# EAGLE design dac single ended 32-2 (EAGLE 4.13)
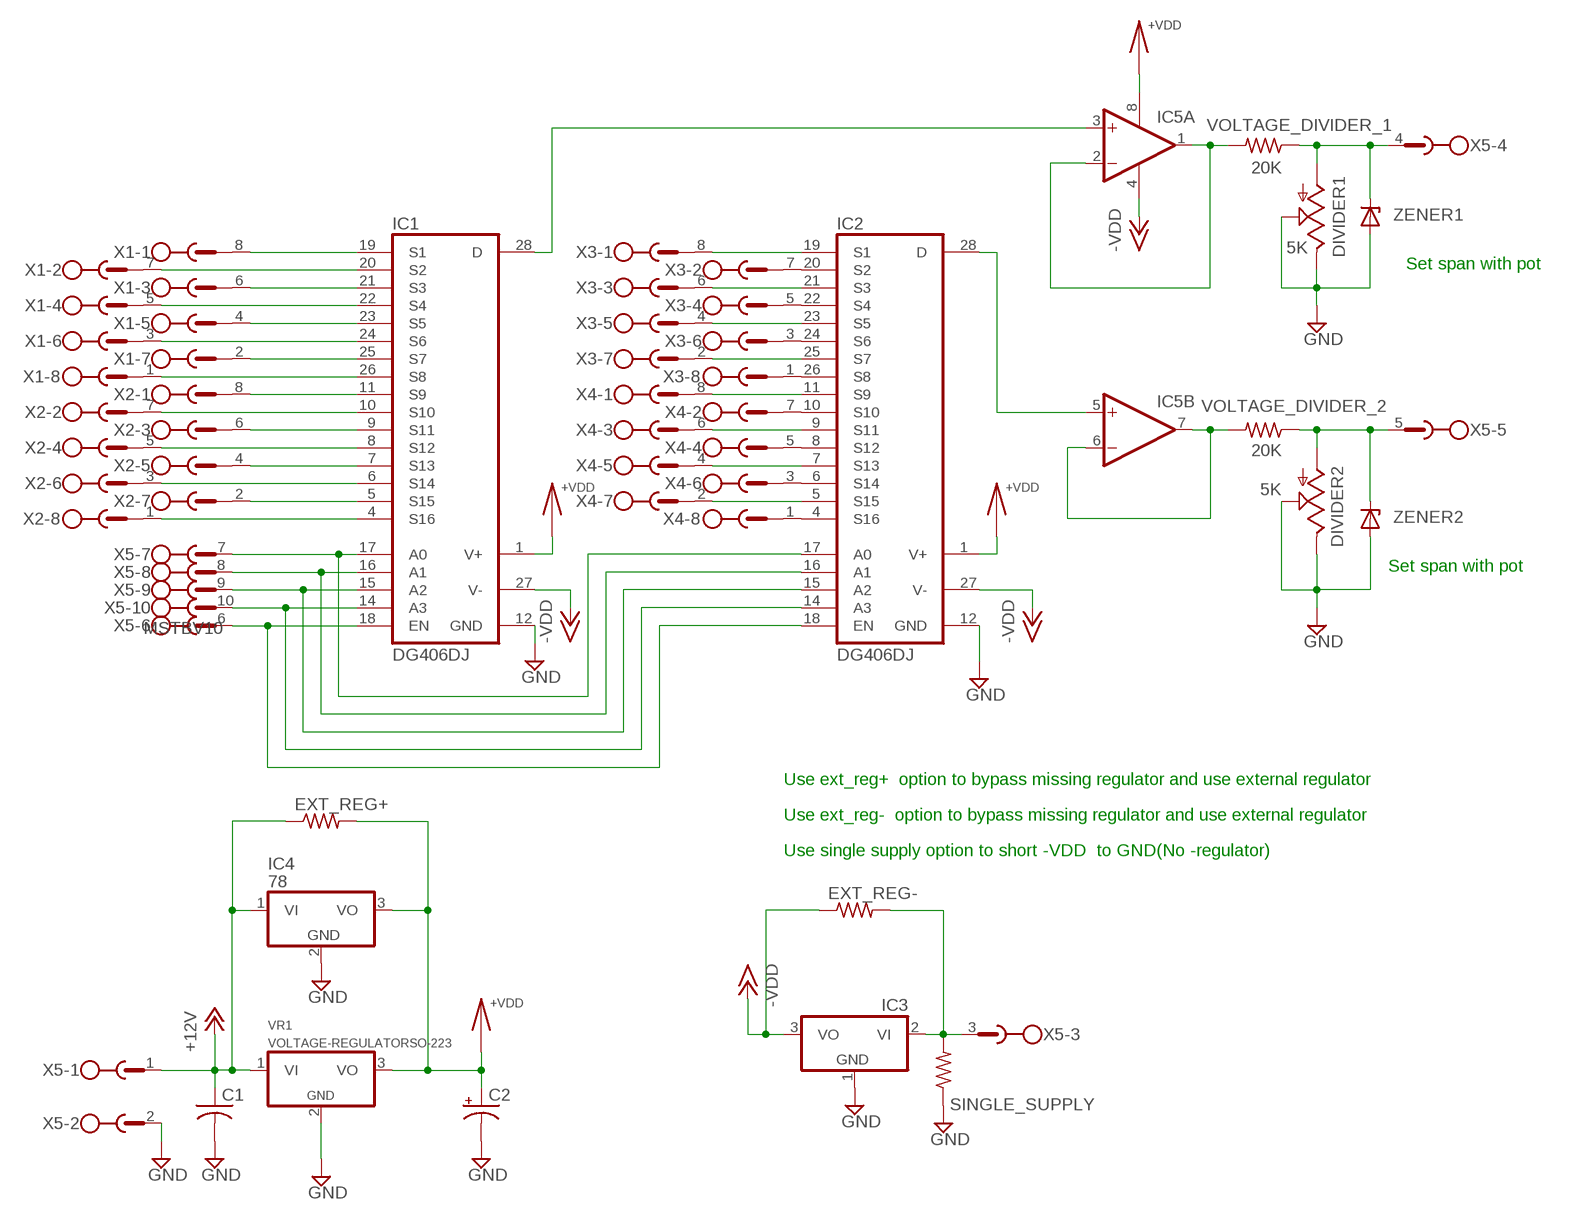
[diagram p0: schematic, sheet 1]

## Parts
C1  CAPACITOR-NO-POLARITYC1210K  [C1210K]
C2  CAPACITOR-ELECTROLYTICG  [PANASONIC_G]
DIVIDER1  5K  TRIM_US-RJ9W  [RJ9W]
DIVIDER2  5K  TRIM_US-RJ9W  [RJ9W]
EXT_REG+  RESISITORM1406  [M1406]
EXT_REG-  RESISITORM1406  [M1406]
IC1  DG406DJ  [DIL28-6]
IC2  DG406DJ  [DIL28-6]
IC3  79  [TO220S]
IC4  78  [TO220S]
IC5  2AMP_P8+4D  [SO08]
SINGLE_SUPPLY  RESISITORM1406  [M1406]
VOLTAGE_DIVIDER_1  20K  RESISITORM1406  [M1406]
VOLTAGE_DIVIDER_2  20K  RESISITORM1406  [M1406]
VR1  VOLTAGE-REGULATORSO-223  [SOT223R_INFINEON]
X1  MSTBV8  [MSTBV8]
X2  MSTBV8  [MSTBV8]
X3  MSTBV8  [MSTBV8]
X4  MSTBV8  [MSTBV8]
X5  MSTBV10  [MSTBV10]
ZENER1  ZENER-DIODESOD80C  [SOD80C]
ZENER2  ZENER-DIODESOD80C  [SOD80C]

## Nets
+12V: C1.1 EXT_REG+.1 IC4.1(VI) VR1.1(VI) X5.1
+VDD: C2.+ EXT_REG+.2 IC1.1(V+) IC2.1(V+) IC4.3(VO) IC5.8(P:V+) VR1.3(VO)
-15V: EXT_REG-.1 IC1.27(V-) IC2.27(V-) IC3.3(VO) IC5.4(P:V-) ; supply symbol labelled -VDD
GND: C1.2 C2.- DIVIDER1.E DIVIDER1.S DIVIDER2.E DIVIDER2.S IC1.12(GND) IC2.12(GND) IC3.1(GND) IC4.2(GND) SINGLE_SUPPLY.1 VR1.2(GND) X5.2 ZENER1.A ZENER2.A
N$1: IC1.19(S1) X1.8
N$2: IC1.20(S2) X1.7
N$3: IC1.21(S3) X1.6
N$4: IC1.22(S4) X1.5
N$5: IC1.23(S5) X1.4
N$6: IC1.24(S6) X1.3
N$7: IC1.25(S7) X1.2
N$8: IC1.26(S8) X1.1
N$9: IC1.11(S9) X2.8
N$10: IC1.10(S10) X2.7
N$11: IC1.9(S11) X2.6
N$12: IC1.8(S12) X2.5
N$13: IC1.7(S13) X2.4
N$14: IC1.6(S14) X2.3
N$15: IC1.5(S15) X2.2
N$16: IC1.4(S16) X2.1
N$17: IC2.19(S1) X3.8
N$18: IC2.20(S2) X3.7
N$19: IC2.21(S3) X3.6
N$20: IC2.22(S4) X3.5
N$21: IC2.23(S5) X3.4
N$22: IC2.24(S6) X3.3
N$23: IC2.25(S7) X3.2
N$24: IC2.26(S8) X3.1
N$25: IC2.11(S9) X4.8
N$26: IC2.10(S10) X4.7
N$27: IC2.9(S11) X4.6
N$28: IC2.8(S12) X4.5
N$29: IC2.7(S13) X4.4
N$30: IC2.6(S14) X4.3
N$31: IC2.5(S15) X4.2
N$32: IC2.4(S16) X4.1
N$33: IC1.17(A0) IC2.17(A0) X5.7
N$34: IC1.16(A1) IC2.16(A1) X5.8
N$35: IC1.15(A2) IC2.15(A2) X5.9
N$36: IC1.14(A3) IC2.14(A3) X5.10
N$37: IC1.18(EN) IC2.18(EN) X5.6
N$38: DIVIDER1.A VOLTAGE_DIVIDER_1.1 X5.4 ZENER1.C
N$40: EXT_REG-.2 IC3.2(VI) SINGLE_SUPPLY.2 X5.3
N$41: IC2.28(D) IC5.5(B:+IN)
N$42: IC5.6(B:-IN) IC5.7(B:OUT) VOLTAGE_DIVIDER_2.2
N$43: IC1.28(D) IC5.3(A:+IN)
N$44: IC5.1(A:OUT) IC5.2(A:-IN) VOLTAGE_DIVIDER_1.2
N$45: DIVIDER2.A VOLTAGE_DIVIDER_2.1 X5.5 ZENER2.C

## Notes on the sheet
- Set span with pot
- Set span with pot
- Use ext_reg+  option to bypass missing regulator and use external regulator
- Use ext_reg-  option to bypass missing regulator and use external regulator
- Use single supply option to short -VDD  to GND(No -regulator)

## Library data of the parts
C1 = 1 Dan's Common Parts:CAPACITOR-NO-POLARITY: CAPACITOR, American symbol
C2 = 1 Dan's Common Parts:CAPACITOR-ELECTROLYTIC: POLARIZED CAPACITOR, American symbol
DIVIDER1 DIVIDER2 = pot:TRIM_US-: POTENTIOMETER
EXT_REG+ EXT_REG- SINGLE_SUPPLY VOLTAGE_DIVIDER_1 VOLTAGE_DIVIDER_2 = 1 Dan's Common Parts:RESISITOR: RESISTOR, American symbol
IC1 IC2 = maxim:DG406DJ: ANALOG MULTIPLEXER
IC3 = linear:79*: Negative VOLTAGE REGULATOR
IC4 = linear:78*: Positive VOLTAGE REGULATOR
IC5 = 1 Dan's Common Parts:2AMP_P8+4: OP AMP
VR1 = 1 Dan's Common Parts:VOLTAGE-REGULATOR: Positive VOLTAGE REGULATOR Source: http://cache.national.com/ds/LM/LM78L05.pdf http://www.fairchildsemi.com/ds/LM/LM7805.pdf
X1-X4 = con-phoenix-500:MSTBV8: PHOENIX
X5 = con-phoenix-508:MSTBV10: PHOENIX
ZENER1 ZENER2 = 1 Dan's Common Parts:ZENER-DIODE: Z-Diode

## Board
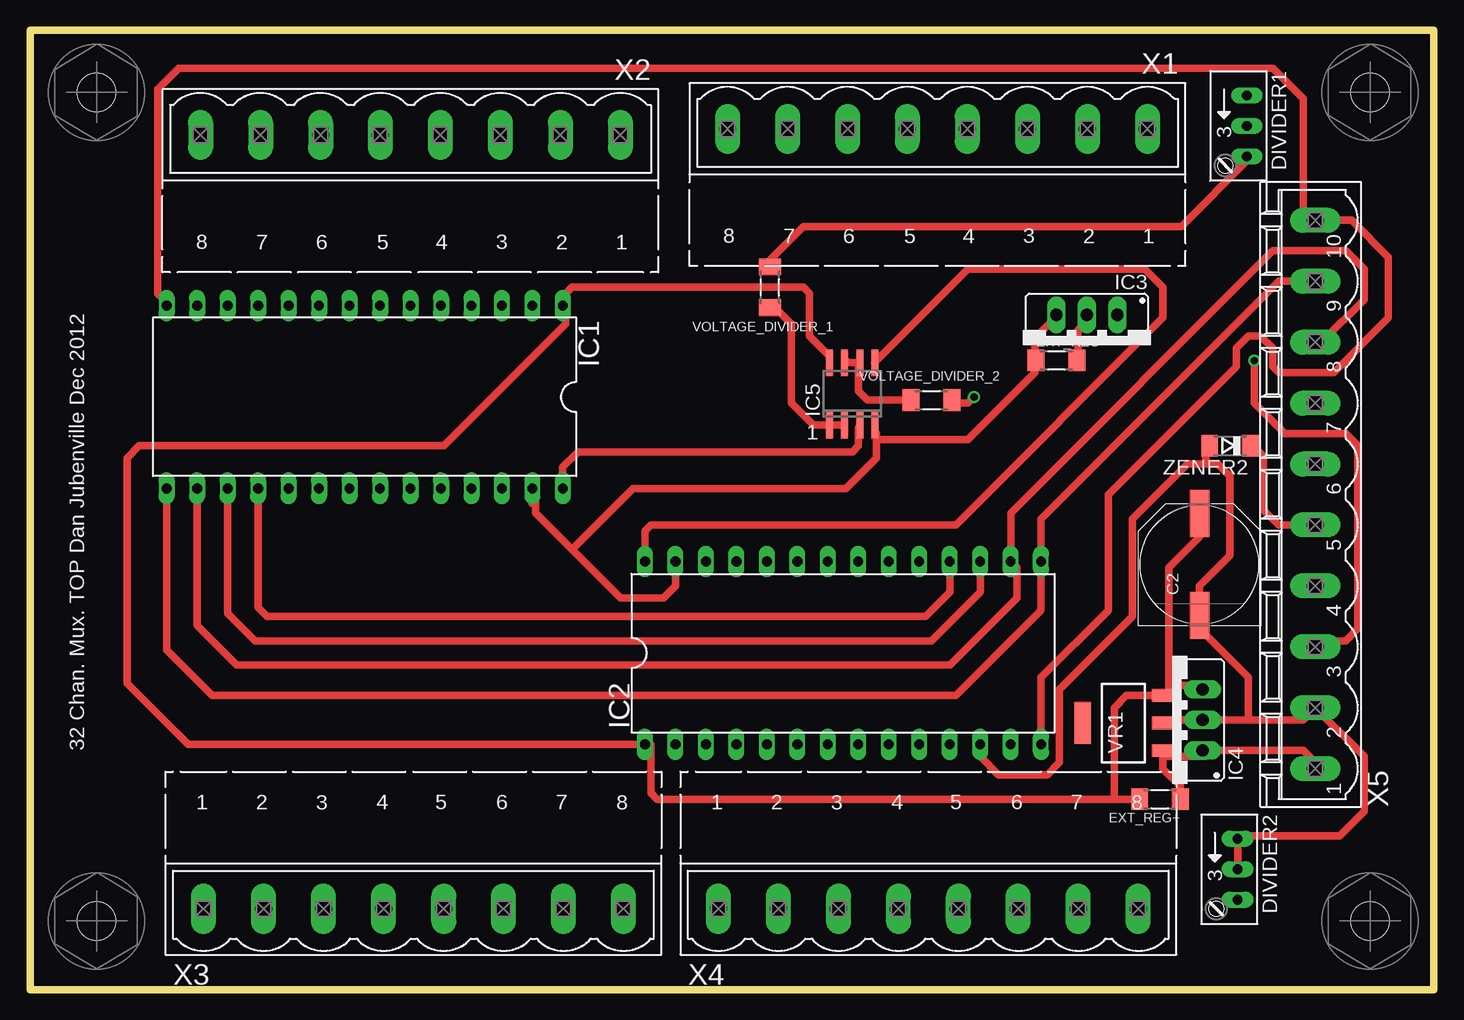
[diagram p1: board, top side]
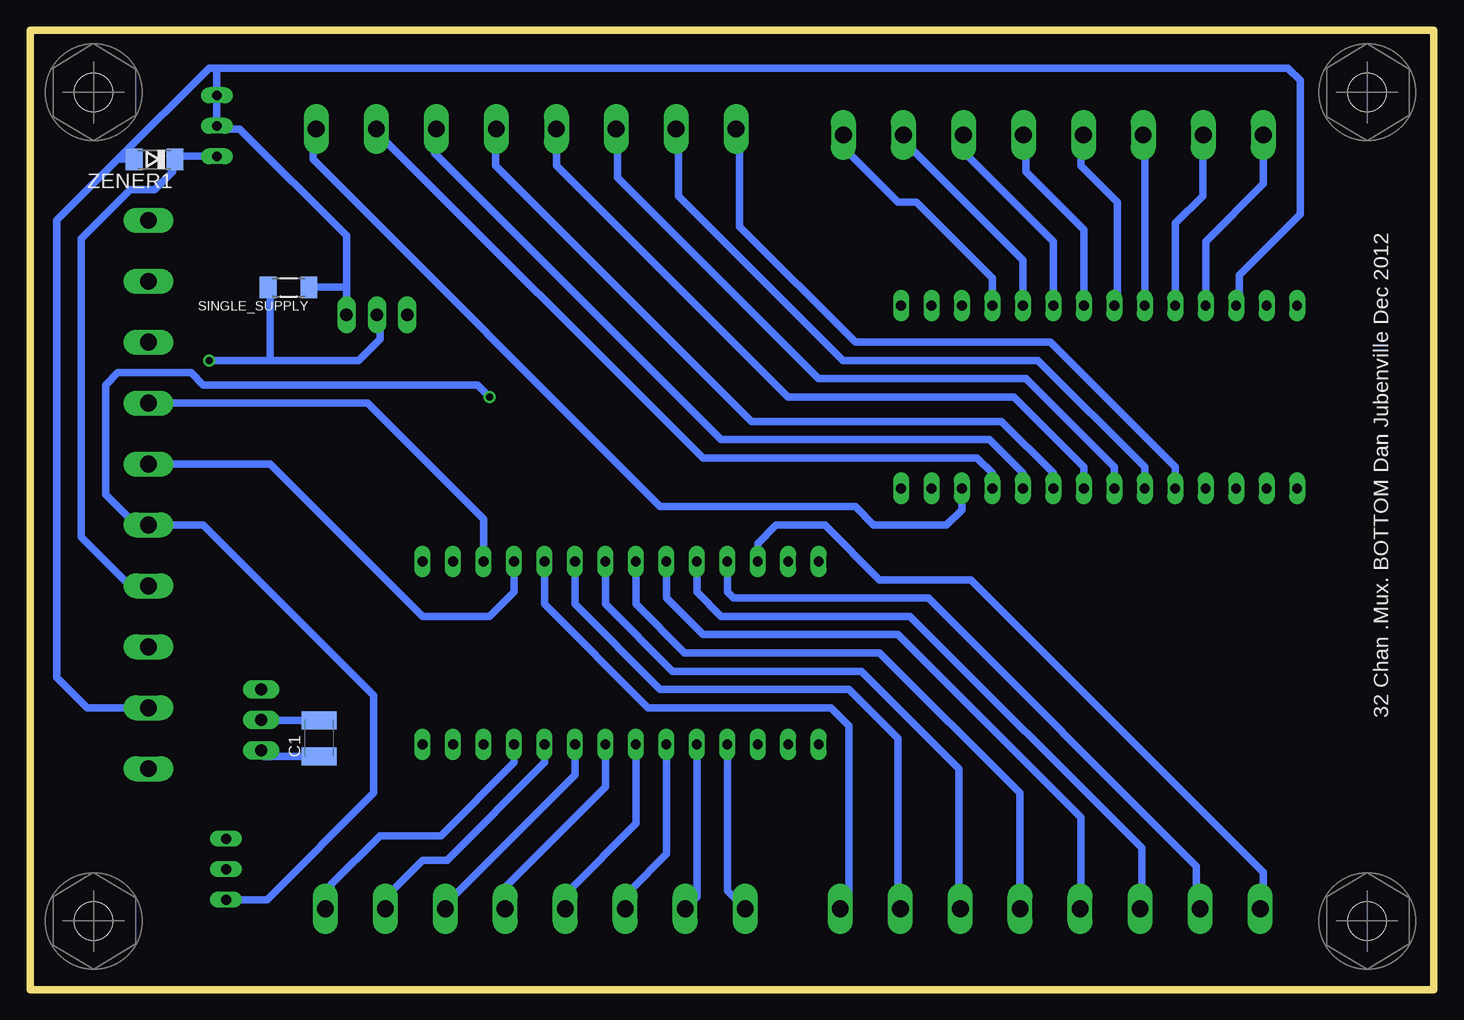
[diagram p2: board, bottom side, seen from below]

Size 117.02 x 80 mm. Coordinates in mm from the lower left corner, seen from the top.
Outline: 0,0 117.02,0 117.02,80 0,80 0,0
Copper layers (1*16): Top 0.035mm / dielectric 1.5mm / Bottom 0.035mm
Design rules "default": minimum track width 20mil, minimum drill 24mil, track to track 15mil, track to pad 15mil, pad to pad 15mil, via to via 15mil, smd to smd 8mil, copper to edge 40mil, drill to drill 8mil, minimum pad ring 10mil, minimum via ring 8mil, stop-mask expansion 4mil, vias tented up to drill 0mil, thermal gap 10mil

### Footprints (pad centres in the part's own frame; a part is rotated, then mirrored left to right if it is on the bottom)
C1210K = smd 1.5 x 2.9: 1 -1.5,0; 2 1.5,0
PANASONIC_G = smd 3.9 x 1.6: + 4.25,0; - -4.25,0
RJ9W = drill 0.813 long: A 2.54,0.635; E -2.54,0.635; S 0,0.635
M1406 = smd 1.4 x 1.8: 1 -1.7,0; 2 1.7,0
DIL28-6 = drill 0.813 long: 1 -16.51,-7.62; 2 -13.97,-7.62; 3 -11.43,-7.62; 4 -8.89,-7.62; 5 -6.35,-7.62; 6 -3.81,-7.62; 7 -1.27,-7.62; 8 1.27,-7.62; 9 3.81,-7.62; 10 6.35,-7.62; 11 8.89,-7.62; 12 11.43,-7.62; 13 13.97,-7.62; 14 16.51,-7.62; 15 16.51,7.62; 16 13.97,7.62; 17 11.43,7.62; 18 8.89,7.62; 19 6.35,7.62; 20 3.81,7.62; 21 1.27,7.62; 22 -1.27,7.62; 23 -3.81,7.62; 24 -6.35,7.62; 25 -8.89,7.62; 26 -11.43,7.62; 27 -13.97,7.62; 28 -16.51,7.62
TO220S = drill 1.016 long: 1 -2.54,-2.54; 2 0,-2.54; 3 2.54,-2.54
SO08 = smd 0.6 x 2.2: 1 -1.905,-2.6; 2 -0.635,-2.6; 3 0.635,-2.6; 4 1.905,-2.6; 5 1.905,2.6; 6 0.635,2.6; 7 -0.635,2.6; 8 -1.905,2.6
SCREW = hole 3.2: 0,0
SOT223R_INFINEON = smd 1.067 x 2.184: 1 -2.311,-3.479; 2 0,-3.48; 3 2.312,-3.48 | smd 3.5 x 1.4: 4 0,3.404
MSTBV8 = drill 1.397 long: 1 -17.501,0; 2 -12.497,0; 3 -7.493,0; 4 -2.489,0; 5 2.515,0; 6 7.493,0; 7 12.497,0; 8 17.501,0
MSTBV10 = drill 1.397 long: 1 -22.86,0; 2 -17.78,0; 3 -12.7,0; 4 -7.62,0; 5 -2.54,0; 6 2.54,0; 7 7.62,0; 8 12.7,0; 9 17.78,0; 10 22.86,0
SOD80C = smd 1.4 x 1.8: A 1.7,0; C -1.7,0

### Placement (x,y rotation side)
C1  92.93,20.95 90 bottom
C2  97.5,35.43 90 top
DIVIDER1  100.8,72 270 top
DIVIDER2  100.04,10.03 270 top
EXT_REG+  94.2,15.87 180 top
EXT_REG-  85.56,52.45 0 top
IC1  27.9,49.4 180 top
IC2  67.78,28.06 0 top
IC3  88.1,53.72 180 top
IC4  95.21,22.47 90 top
IC5  68.54,49.65 0 top
SINGLE_SUPPLY  95.47,58.54 180 bottom
U$1  [SCREW]  5.55,74.8 0 top
U$2  [SCREW]  5.55,5.71 0 top
U$3  [SCREW]  111.72,5.71 0 top
U$4  [SCREW]  111.72,74.8 0 top
VOLTAGE_DIVIDER_1  61.68,58.54 270 top
VOLTAGE_DIVIDER_2  75.15,49.14 180 top
VR1  91.15,22.22 90 top
X1  75.65,71.75 180 top
X2  31.71,71.24 180 top
X3  31.97,6.73 0 top
X4  74.89,6.73 0 top
X5  107.15,41.27 90 top
ZENER1  106.64,69.21 180 bottom
ZENER2  100.04,45.33 180 top

### Tracks (layer width: path | path; a pad name or v marks a point on that pad's centre or on a via)
+12V
  Top 0.61: 98.51,19.93 IC4.1 | 98.51,19.93 98.01,19.43 94.6,19.43 94.45,19.58 94.45,19.93 | X5.1 107.66,18.41 106.13,19.93 98.51,19.93 | EXT_REG+.1 95.9,16.96 94.45,18.41 94.45,19.43 | 94.45,19.93 94.42,19.91 VR1.1 | 94.45,19.43 94.45,19.93 | VR1.1 94.45,19.73 94.45,19.43 | 94.45,19.93 94.6,19.93 VR1.1
  Bottom 0.61: IC4.1 98.01,19.93 97.52,19.45 C1.1
+VDD
  Top 0.61: 94.96,25.52 94.96,25.37 97.65,25.37 98.01,25.01 IC4.3 | 94.96,25.52 94.96,35.17 97.5,37.71 C2.+ 97.5,39.75 | 93.94,24.51 91.4,24.51 90.39,23.49 90.39,15.87 | 93.94,24.51 94.09,24.51 | 90.39,15.87 52.29,15.87 51.78,16.38 51.78,20.44 IC2.1 13.17,20.44 8.09,25.52 8.09,44.32 9.11,45.33 34.51,45.33 44.67,55.49 44.67,57.02 IC1.1 44.16,57.02 44.16,57.53 45.17,58.54 64.48,58.54 64.99,58.03 64.99,54.48 66.64,52.83 IC5.8 | 90.39,15.87 EXT_REG+.2 | 94.96,25.52 94.96,24.86 VR1.3 94.6,24.51 93.94,24.51
-15V
  Top 0.61: 41.87,40.76 41.87,40.51 | 41.87,40.76 IC1.27 | 83.78,52.45 83.78,54.32 85.81,56.35 85.81,56.51 IC3.3 | IC5.4 70.45,46.48 70.57,46.35 70.57,45.84 | 53.81,34.16 IC2.27 53.81,33.65 52.79,32.63 49.24,32.63 45.17,36.7 | 41.87,40.76 42.13,40.76 42.13,39.75 45.17,36.7 | 70.57,45.84 70.57,44.32 68.03,41.78 50.25,41.78 45.17,36.7 | 70.57,45.84 78.19,45.84 83.78,51.43 83.78,52.45 | 83.78,52.45 EXT_REG-.1
GND
  Top 0.61: 98.01,43.81 99.02,43.81 100.04,42.79 100.04,36.19 97.5,33.65 C2.- 97.5,30.09 101.56,26.03 101.56,22.47 | 94.45,22.47 IC4.2 101.56,22.47 | 101.56,22.47 106.13,22.47 X5.2 111.21,19.43 111.21,14.85 109.18,12.82 101.05,12.82 100.67,12.44 | 98.01,43.81 98.01,45.16 98.18,45.33 ZENER2.A 98.51,45.33 | 100.67,12.44 100.55,12.31 | 100.67,12.44 DIVIDER2.E 100.67,9.9 | 100.67,9.9 DIVIDER2.S | 100.67,9.9 100.55,9.77 | 98.01,43.81 96.48,43.81 91.91,39.24 91.91,31.11 85.81,25.01 85.81,18.92 84.8,17.9 80.73,17.9 79.21,19.43 IC2.12 | 94.45,22.47 94.45,22.4 VR1.2 | 94.45,22.47 94.37,22.47
  Bottom 0.61: X5.2 112.23,23.49 114.77,26.03 114.77,64.13 109.69,69.21 | IC1.12 16.22,57.27 16.22,59.56 11.14,64.64 11.14,75.81 12.15,76.83 101.56,76.83 | IC4.2 98.01,22.47 97.98,22.45 C1.2 | 90.64,58.54 SINGLE_SUPPLY.1 | 109.69,69.21 102.07,76.83 101.56,76.83 | 90.64,58.54 90.64,62.86 99.53,71.75 101.05,71.75 101.44,72.13 | 90.64,58.54 IC3.1 | 101.44,72.13 101.56,72.26 | 101.44,72.13 DIVIDER1.S DIVIDER1.E | DIVIDER1.E 101.44,74.67 101.56,74.8 | DIVIDER1.E 101.44,76.7 101.56,76.83 | 109.69,69.21 ZENER1.A
N$1
  Bottom 0.61: IC1.19 21.55,43.56 31.97,53.97 48.22,53.97 57.87,63.62 57.87,71.24 58.38,71.75 X1.8
N$2
  Bottom 0.61: IC1.20 24.09,43.56 32.98,52.45 49.24,52.45 62.95,66.16 62.95,71.75 X1.7
N$3
  Bottom 0.61: IC1.21 26.63,43.56 34,50.92 51.27,50.92 68.03,67.69 68.03,71.75 X1.6
N$4
  Bottom 0.61: IC1.22 29.17,43.56 35.01,49.4 53.81,49.4 73.11,68.7 73.11,71.75 X1.5
N$5
  Bottom 0.61: IC1.23 31.71,43.05 36.03,47.37 56.86,47.37 78.19,68.7 78.19,72.26 77.69,71.75 X1.4
N$6
  Bottom 0.61: IC1.24 34.25,43.05 37.05,45.84 59.4,45.84 83.27,69.72 83.27,71.75 X1.3
N$7
  Bottom 0.61: IC1.25 36.79,43.05 38.06,44.32 60.92,44.32 88.35,71.75 X1.2
N$8
  Bottom 0.61: IC1.26 39.33,40 40.6,38.73 46.7,38.73 48.22,40.25 64.48,40.25 93.43,69.21 93.43,71.24 92.93,71.75 X1.1
N$9
  Bottom 0.61: IC1.11 19.01,62.35 14.19,67.18 14.19,71.24 X2.8
N$10
  Bottom 0.61: IC1.10 21.55,63.88 19.27,66.16 19.27,71.24 | 19.27,71.24 19.27,71.75 | 19.27,71.24 X2.7
N$11
  Bottom 0.61: IC1.9 24.09,69.46 24.35,69.72 24.35,71.24 X2.6 23.84,71.24
N$12
  Bottom 0.61: 28.92,71.24 X2.5 29.43,71.24 29.43,68.7 26.38,65.65 26.38,57.27 IC1.8
N$13
  Bottom 0.61: 34,71.24 X2.4 34.51,71.24 34,70.73 34,68.19 29.17,63.37 IC1.7
N$14
  Bottom 0.61: 39.59,70.73 39.08,71.24 X2.3 39.59,71.24 39.08,70.73 39.08,69.72 31.71,62.35 IC1.6
N$15
  Bottom 0.61: IC1.5 34.25,60.83 44.16,70.73 44.16,71.24 X2.2
N$16
  Bottom 0.61: IC1.4 36.79,59.3 43.14,65.65 44.67,65.65 49.24,70.23 49.24,71.24 X2.1
N$17
  Bottom 0.61: IC2.19 74.13,32.13 65.49,23.49 50.25,23.49 48.73,21.97 48.73,7.74 49.75,6.73 X3.8
N$18
  Bottom 0.61: IC2.20 71.59,32.13 64.48,25.01 48.73,25.01 44.67,20.95 44.67,6.22 44.16,6.73 X3.7
N$19
  Bottom 0.61: IC2.21 69.05,32.13 63.46,26.54 47.71,26.54 39.59,18.41 39.59,7.23 39.08,6.73 X3.6
N$20
  Bottom 0.61: IC2.22 66.51,32.13 62.45,28.06 46.19,28.06 34.51,16.38 34.51,6.73 X3.5
N$21
  Bottom 0.61: IC2.23 63.97,32.63 60.92,29.59 44.67,29.59 29.43,14.35 29.43,7.23 28.92,6.73 X3.4
N$22
  Bottom 0.61: IC2.24 61.43,33.14 59.4,31.11 43.65,31.11 24.35,11.81 24.35,7.23 24.85,6.73 X3.3
N$23
  Bottom 0.61: IC2.25 58.89,33.14 58.38,32.63 42.13,32.63 19.77,10.28 19.77,7.23 19.27,6.73 X3.2
N$24
  Bottom 0.61: IC2.26 56.35,37.21 54.83,38.73 50.76,38.73 46.19,34.16 38.57,34.16 14.19,9.77 14.19,6.73 14.69,6.22 14.69,6.73 X3.1
N$25
  Bottom 0.61: IC2.11 76.67,18.92 82.77,12.82 87.85,12.82 91.91,8.76 91.91,7.23 92.42,6.73 X4.8
N$26
  Bottom 0.61: IC2.10 74.13,18.92 82.26,10.79 84.29,10.79 87.34,7.74 87.34,6.73 X4.7
N$27
  Bottom 0.61: X4.6 82.77,6.73 71.59,17.9 IC2.9
N$28
  Bottom 0.61: IC2.8 69.05,16.89 77.69,8.25 77.69,6.73 X4.5
N$29
  Bottom 0.61: IC2.7 66.51,13.84 72.1,8.25 72.1,7.23 72.61,6.73 X4.4
N$30
  Bottom 0.61: IC2.6 63.97,11.3 67.02,8.25 67.02,7.23 67.53,6.73 X4.3
N$31
  Bottom 0.61: X4.2 62.45,6.73 61.43,7.74 IC2.5
N$32
  Bottom 0.61: X4.1 57.37,6.73 58.89,8.25 IC2.4
N$33
  Top 0.61: IC1.17 16.47,31.36 18.76,29.08 75.15,29.08 79.21,33.14 IC2.17
  Bottom 0.61: IC2.17 79.21,39.24 88.86,48.89 X5.7
N$34
  Top 0.61: IC1.16 13.93,30.35 17.23,27.05 76.67,27.05 82.26,32.63 82.26,35.17 IC2.16 81.75,39.75 103.59,61.59 109.69,61.59 111.21,60.07 111.21,57.53 107.66,53.97 X5.8
N$35
  Top 0.61: IC1.15 11.39,28.32 15.2,24.51 77.18,24.51 84.29,31.62 IC2.15 84.29,39.24 104.1,59.05 X5.9 107.66,59.05
N$36
  Top 0.61: IC1.14 11.65,57.02 10.63,58.03 10.63,75.05 12.41,76.83 103.59,76.83 106.13,74.29 106.13,64.13 X5.10 110.2,64.13 113.25,61.08 113.25,56 108.67,51.43 104.1,51.43 103.59,51.94 103.59,53.46 102.58,54.48 101.56,54.48 100.55,53.46 100.55,51.94 89.88,41.27 89.88,31.62 84.29,26.03 IC2.14
N$37
  Top 0.61: IC1.18 19.01,31.87 19.77,31.11 74.64,31.11 76.67,33.14 IC2.18
  Bottom 0.61: X5.6 96.99,43.81 84.29,31.11 78.7,31.11 76.67,33.14 IC2.18
N$38
  Top 0.61: VOLTAGE_DIVIDER_1.1 61.68,60.83 64.48,63.62 95.97,63.62 101.56,69.21 101.44,69.34 DIVIDER1.A
  Bottom 0.61: DIVIDER1.A 105.12,69.46 | 105.12,69.46 105.37,69.46 | X5.4 108.67,33.65 112.74,37.71 112.74,62.61 108.67,66.67 106.64,66.67 105.12,68.19 105.12,68.7 105.12,69.21 | 105.12,69.21 ZENER1.C | 105.12,69.46 105.12,69.21
N$40  (via drill 0.6)
  Top 0.61: EXT_REG-.2 87.34,52.45 87.34,54.99 87.85,55.49 87.85,56 IC3.2 | v102.07,52.45 102.07,48.89 104.61,46.35 109.69,46.35 110.71,45.33 110.71,30.09 109.69,29.08 107.66,29.08 X5.3
  Bottom 0.61: 97.5,58.54 SINGLE_SUPPLY.2 96.99,58.54 96.99,52.45 | 96.99,52.45 89.62,52.45 87.85,54.22 87.85,56 IC3.2 88.35,56.51 | v102.07,52.45 96.99,52.45
N$41
  Top 0.61: IC5.5 70.38,52.25 78.19,60.07 92.93,60.07 94.45,58.54 94.45,56 77.18,38.73 51.78,38.73 51.27,38.22 IC2.28
N$42
  Top 0.61: IC5.7 67.91,52.32 68.03,52.45 68.23,52.25 IC5.6 69.18,52.07 69.05,51.94 69.05,49.91 69.81,49.14 VOLTAGE_DIVIDER_2.2
N$43
  Top 0.61: 44.16,41.78 IC1.28 44.41,43.56 45.68,44.83 68.54,44.83 69.05,45.33 69.05,46.86 69.18,46.98 IC5.3
N$44
  Top 0.61: IC5.2 67.84,47.05 67.78,47.11 67.72,47.05 IC5.1 65.3,47.05 63.46,48.89 63.46,55.49 61.94,57.02 61.86,57.02 VOLTAGE_DIVIDER_1.2
N$45  (via drill 0.6)
  Top 0.61: X5.5 104.1,38.73 102.83,40 102.83,44.49 101.99,45.33 ZENER2.C 101.56,45.33 | VOLTAGE_DIVIDER_2.1 77.1,48.89 78.19,48.89 v78.7,49.4
  Bottom 0.61: 108.17,38.73 X5.5 102.58,38.73 88.35,24.51 88.35,16.38 97.24,7.49 DIVIDER2.A | 108.17,38.73 108.67,38.73 | v78.7,49.4 79.72,50.41 102.58,50.41 103.59,51.43 109.69,51.43 110.71,50.41 110.71,41.27 108.17,38.73

### Text on the board
tPlace: 32 Chan. Mux. TOP Dan Jubenville Dec 2012
bPlace: 32 Chan .Mux. BOTTOM Dan Jubenville Dec 2012